# EAGLE design AquaNode Model A (EAGLE 7.3.0)
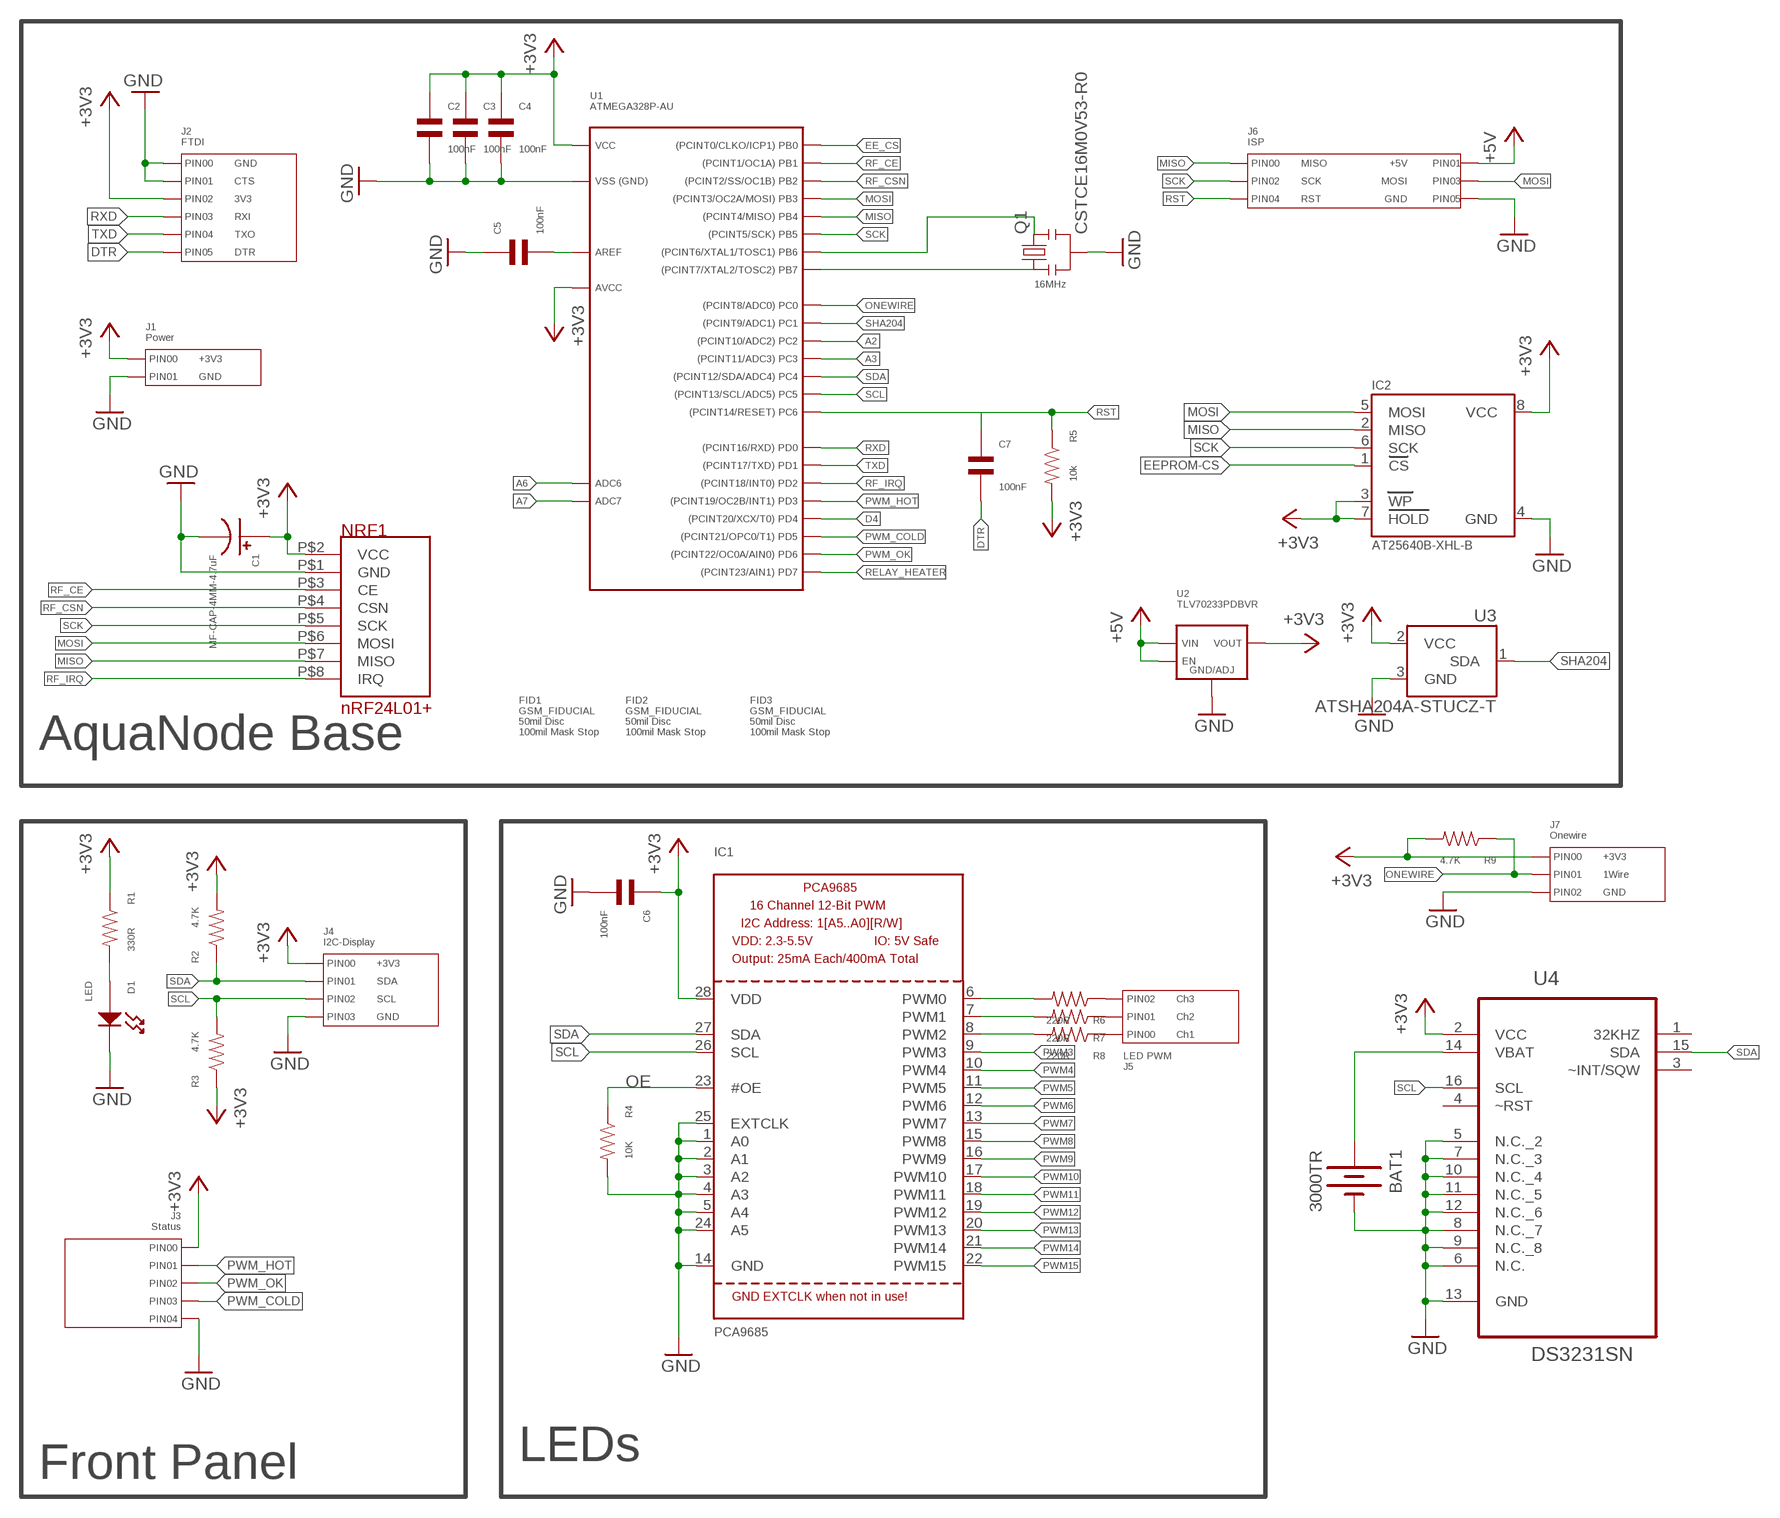
[diagram p0: schematic, sheet 1]

## Parts
BAT1  3000TR  BATTERY12MM  [BATTCON_12MM]
C1  MF-CAP-4MM-4.7uF  CAPACITOR_P_4MM  [CP4MM]
C2  100nF  CAPACITOR_NP_0603  [C0603]
C3  100nF  CAPACITOR_NP_0603  [C0603]
C4  100nF  CAPACITOR_NP_0603  [C0603]
C5  100nF  CAPACITOR_NP_0603  [C0603]
C6  100nF  CAPACITOR_NP_0603  [C0603]
C7  100nF  CAPACITOR_NP_0603  [C0603]
D1  LED  LED_SINGLE_0805  [LED0805]
FID1  GSM_FIDUCIAL  [GSM_FIDUCIAL]
FID2  GSM_FIDUCIAL  [GSM_FIDUCIAL]
FID3  GSM_FIDUCIAL  [GSM_FIDUCIAL]
IC1  PCA9685  [TSSOP28]
IC2  AT25640B-XHL-B  EEPROM_SPI_AT25040ATSSOP  [TSSOP8-4.4MM]
J1  Power  HEADER_01X02_PTH_2.54MM  [PTH_2.54MM_01X02]
J2  FTDI  HEADER_01X06_PTH_2.54MM  [PTH_2.54MM_01X06]
J3  Status  HEADER_01X05_PTH_2.54MM  [PTH_2.54MM_01X05]
J4  I2C-Display  HEADER_01X04_PTH_2.54MM  [PTH_2.54MM_01X04]
J5  LED PWM  HEADER_01X03_PTH_2.54MM  [PTH_2.54MM_01X03]
J6  ISP  HEADER_02X03_PTH_2.54MM  [PTH_2.54MM_02X03]
J7  Onewire  HEADER_01X03_PTH_2.54MM  [PTH_2.54MM_01X03]
NRF1  4Fx2-254mm  NRF24L01+.EBAY  [NRF24L01+.EBAY]
Q1  CSTCE16M0V53-R0  RESONATORSMD  [RESONATOR-SMD]
R1  330R  RESISTOR_0603  [R0603]
R2  4.7K  RESISTOR_0603  [R0603]
R3  4.7K  RESISTOR_0603  [R0603]
R4  10K  RESISTOR_0603  [R0603]
R5  10k  RESISTOR_0603  [R0603]
R6  220R  RESISTOR_0603  [R0603]
R7  220R  RESISTOR_0603  [R0603]
R8  220R  RESISTOR_0603  [R0603]
R9  4.7K  RESISTOR_0603  [R0603]
U1  ATMEGA328P-AU  [TQFP32]
U2  TLV70233PDBVR  [SOT-23-5]
U3  ATSHA204A-STUCZ-T  ATSHA204-TSU  [SOT23-3]
U4  DS3231SN  [SOIC127P1032X265-16N]

## Nets
+3V3 [power1]: C1.P$1 C2.P$1 C3.P$1 C4.P$1 C6.P$1 IC1.28(VDD) IC2.3(WP) IC2.7(HOLD) IC2.8(VCC) J1.P$2(PIN0) J2.P$3(PIN2) J3.P$1(PIN0) J4.P$1(PIN0) J7.P$1(PIN0) NRF1.P$2(VCC) R1.P$1 R2.P$2 R3.P$1 R5.P$2 R9.P$2 U1.P$4(VCC) U1.P$6(VCC) U1.P$18(AVCC) U2.P$5(VOUT) U3.2(VCC) U4.2(VCC)
+5V [power1]: J6.P$2(PIN1) U2.P$1(VIN) U2.P$3(EN)
A2: U1.P$25(PC2)
A3: U1.P$26(PC3)
A6: U1.P$19(ADC6)
A7: U1.P$22(ADC7)
D4: U1.P$2(PD4)
DTR: C7.P$2 J2.P$6(PIN5)
EE_CS: U1.P$12(PB0)
EEPROM-CS: IC2.1(CS)
GND [power1]: BAT1.GND(-) C1.P$2 C2.P$2 C3.P$2 C4.P$2 C5.P$1 C6.P$2 D1.CATHODE IC1.1(A0) IC1.2(A1) IC1.3(A2) IC1.4(A3) IC1.5(A4) IC1.14(GND) IC1.24(A5) IC1.25(EXTCLK) IC2.4(GND) J1.P$1(PIN1) J2.P$1(PIN0) J2.P$2(PIN1) J3.P$5(PIN4) J4.P$4(PIN3) J6.P$6(PIN5) J7.P$3(PIN2) NRF1.P$1(GND) Q1.2 R4.P$2 U1.P$3(GND) U1.P$5(GND) U1.P$21(GND) U2.P$2(GND/ADJ) U3.3(GND) U4.5(N.C._2) U4.6(N.C.) U4.7(N.C._3) U4.8(N.C._7) U4.9(N.C._8) U4.10(N.C._4) U4.11(N.C._5) U4.12(N.C._6) U4.13(GND)
MISO: IC2.2(MISO) J6.P$1(PIN0) NRF1.P$7(MISO) U1.P$16(PB4)
MOSI: IC2.5(MOSI) J6.P$4(PIN3) NRF1.P$6(MOSI) U1.P$15(PB3)
N$1: D1.ANODE R1.P$2
N$2: J5.P$3(PIN2) R6.P$1
N$3: J5.P$2(PIN1) R7.P$1
N$4: C5.P$2 U1.P$20(AREF)
N$5: BAT1.PWR@1(+) U4.14(VBAT)
N$6: J5.P$1(PIN0) R8.P$1
N$22: Q1.3 U1.P$7(PB6)
N$23: Q1.1 U1.P$8(PB7)
OE: IC1.23(#OE) R4.P$1
ONEWIRE: J7.P$2(PIN1) R9.P$1 U1.P$23(PC0)
PWM0: IC1.6(PWM0) R6.P$2
PWM1: IC1.7(PWM1) R7.P$2
PWM2: IC1.8(PWM2) R8.P$2
PWM3: IC1.9(PWM3)
PWM4: IC1.10(PWM4)
PWM5: IC1.11(PWM5)
PWM6: IC1.12(PWM6)
PWM7: IC1.13(PWM7)
PWM8: IC1.15(PWM8)
PWM9: IC1.16(PWM9)
PWM10: IC1.17(PWM10)
PWM11: IC1.18(PWM11)
PWM12: IC1.19(PWM12)
PWM13: IC1.20(PWM13)
PWM14: IC1.21(PWM14)
PWM15: IC1.22(PWM15)
PWM_COLD: J3.P$4(PIN3) U1.P$9(PD5)
PWM_HOT: J3.P$2(PIN1) U1.P$1(PD3)
PWM_OK: J3.P$3(PIN2) U1.P$10(PD6)
RELAY_HEATER: U1.P$11(PD7)
RF_CE: NRF1.P$3(CE) U1.P$13(PB1)
RF_CSN: NRF1.P$4(CSN) U1.P$14(PB2)
RF_IRQ: NRF1.P$8(IRQ) U1.P$32(PD2)
RST: C7.P$1 J6.P$5(PIN4) R5.P$1 U1.P$29(PC6)
RXD: J2.P$4(PIN3) U1.P$30(PD0)
SCK: IC2.6(SCK) J6.P$3(PIN2) NRF1.P$5(SCK) U1.P$17(PB5)
SCL: IC1.26(SCL) J4.P$3(PIN2) R3.P$2 U1.P$28(PC5) U4.16(SCL)
SDA: IC1.27(SDA) J4.P$2(PIN1) R2.P$1 U1.P$27(PC4) U4.15(SDA)
SHA204: U1.P$24(PC1) U3.1(SDA)
TXD: J2.P$5(PIN4) U1.P$31(PD1)
Unconnected: U4.1(32KHZ) U4.3(~INT/SQW) U4.4(~RST)

## Notes on the sheet
- 16MHz
- AquaNode Base
- LEDs
- Front Panel

## Library data of the parts
BAT1 = SparkFun-Electromechanical:BATTERY: Battery Holders Various common sizes : AA, AAA, 20mm coin cell and 12mm coin cell. 20MM_4LEGS, BATT-10373
C1 = MF_Passives:CAPACITOR_P: Library: MF_Passives Description: Device for Polarized Capacitors. Manufacture part number (MFG#), Voltage Rating, and Tolerance can be added via Attributes.; MFG#: N/A; TOLERANCE: N/A; VOLTAGE: N/A
C2-C7 = MF_Passives:CAPACITOR_NP: Library: MF_Passives Description: Device for Non-Polarized Capacitors. Manufacture part number (MFG#), Voltage, Temperature Coefficient, and Tolerance can be added via Attributes.; MFG#: N/A; TEMP_COF: N/A; TOLERANCE: N/A; VOLTAGE: N/A
D1 = MF_LEDs:LED_SINGLE: Library: MF_LEDs Description: Device for Single LED Packages. Manufacture part number (MFG#) can be added via Attributes.
FID1-FID3 = MF_Aesthetics:GSM_FIDUCIAL: Library: MF_Aesthetics Description: Fiducial marking for PCB alignment inside PNP and other machines.
IC1 = microbuilder:PCA9685: PCA9685 - 16 Channel 12-Bit I2C PWM Controller 5.0V tolerant 16 channel, 12-bit I2C PWM controller with 25mA per output (max. 400mA total) Digikey: 568-5931-1-ND
IC2 = microbuilder:EEPROM_SPI_AT25040A: AT25010a/40a EEPROM SOIC8 AT25010a, 1K (128 x 8 bit) - Digikey: AT25010AN-10SU2.7-ND AT25040a, 4K (256 x 8 bit) - Digikey: AT25040AN-10SU1.8-ND TSSOP8 AT25010a, 1K (128 x 8 bit) - Digikey: AT25010A-10TU-1.8-ND AT25040a, 4K (256 x 8 bit) - Digikey: AT25040A-10TU-1.8-ND
J1 = MF_Connectors:HEADER_01X02: Library: MF_Connectors Description: Header Connector with 02 Positions and 01 Rows. Use the LABEL Attribute to label the pin on the schematic and PCB. You can remove the attributes on the PCB by using the SMASH function on the part and then deleting the text.; LABEL00: +3V3; LABEL01: GND
J2 = MF_Connectors:HEADER_01X06: Library: MF_Connectors Description: Header Connector with 6 Positions and 01 Rows. Use the LABEL Attribute to label the pin on the schematic and PCB. You can remove the attributes on the PCB by using the SMASH function on the part and then deleting the text.; LABEL00: GND; LABEL01: CTS; LABEL02: 3V3; LABEL03: RXI; LABEL04: TXO; LABEL05: DTR
J3 = MF_Connectors:HEADER_01X05: Library: MF_Connectors Description: Header Connector with 5 Positions and 01 Rows. Use the LABEL Attribute to label the pin on the schematic and PCB. You can remove the attributes on the PCB by using the SMASH function on the part and then deleting the text.; LABEL00: +3V3; LABEL01: Hot; LABEL02: OK; LABEL03: Cold; LABEL04: GND
J4 = MF_Connectors:HEADER_01X04: Library: MF_Connectors Description: Header Connector with 04 Positions and 01 Rows. Use the LABEL Attribute to label the pin on the schematic and PCB. You can remove the attributes on the PCB by using the SMASH function on the part and then deleting the text.; LABEL00: +3V3; LABEL01: SDA; LABEL02: SCL; LABEL03: GND
J5 = MF_Connectors:HEADER_01X03: Library: MF_Connectors Description: Header Connector with 03 Positions and 01 Rows. Use the LABEL Attribute to label the pin on the schematic and PCB. You can remove the attributes on the PCB by using the SMASH function on the part and then deleting the text.; LABEL00: Ch1; LABEL01: Ch2; LABEL02: Ch3
J6 = MF_Connectors:HEADER_02X03: Library: MF_Connectors Description: Header Connector with 6 Positions and 02 Rows. Use the LABEL Attribute to label the pin on the schematic and PCB. You can remove the attributes on the PCB by using the SMASH function on the part and then deleting the text.; LABEL00: MISO; LABEL01: +5V; LABEL02: SCK; LABEL03: MOSI; LABEL04: RST; LABEL05: GND
J7 = MF_Connectors:HEADER_01X03: Library: MF_Connectors Description: Header Connector with 03 Positions and 01 Rows. Use the LABEL Attribute to label the pin on the schematic and PCB. You can remove the attributes on the PCB by using the SMASH function on the part and then deleting the text.; LABEL00: +3V3; LABEL01: 1Wire; LABEL02: GND
NRF1 = TDK:NRF24L01+.EBAY
Q1 = _allyourbase:RESONATOR: Resonator Small SMD resonator. This is the itty bitty 10/20MHz resonators with built in caps. CSTCE10M0G55 and CSTCE20M0V53. Footprint has been reviewed closely but hasn't been tested yet.
R1-R9 = MF_Passives:RESISTOR: Library: MF_Passives Description: Device for Resistors. Manufacture part number (MFG#), Voltage, Tolerance, and Wattage Rating can be added via Attributes.; MFG#: N/A; TOLERANCE: N/A; VOLTAGE: N/A; WATTAGE: N/A
U1 = MF_IC_Digital:ATMEGA328P: Manufacturer Part #: ATMEGA328P Manufacturer: Atmel Description: 8-bit Microcontrollers - MCU 32KB In-system Flash 20MHz 1.8V-5.5V
U2 = MF_IC_Power:TLV702: Manufacturer Part #: TLV702 Manufacturer: Texas Instruments Description: LDO Voltage Regulators
U3 = SparkFun-DigitalIC:ATSHA204: Atmel ATSHA204 The Atmel ATSHA204 is an optimized authentication chip that includes a 4.5Kb EEPROM. This array can be used for storage of keys, miscellaneous read/write, read-only, password or secret data, and consumption tracking. Access to the various sections of memory can be restricted in a variety of ways and then the configuration locked to prevent changes.
U4 = Maxim_By_element14_Batch_1:DS3231SN: Extremely Accurate I2C-Integrated RTC/TCXO/Crystal; MPN: DS3231SN#; OC_FARNELL: 1593292; OC_NEWARK: 68K3406; PACKAGE: SOIC-16; SUPPLIER: Maxim

## Net classes
2 VIN: width 0.762 mm, clearance 0.381 mm

## Board
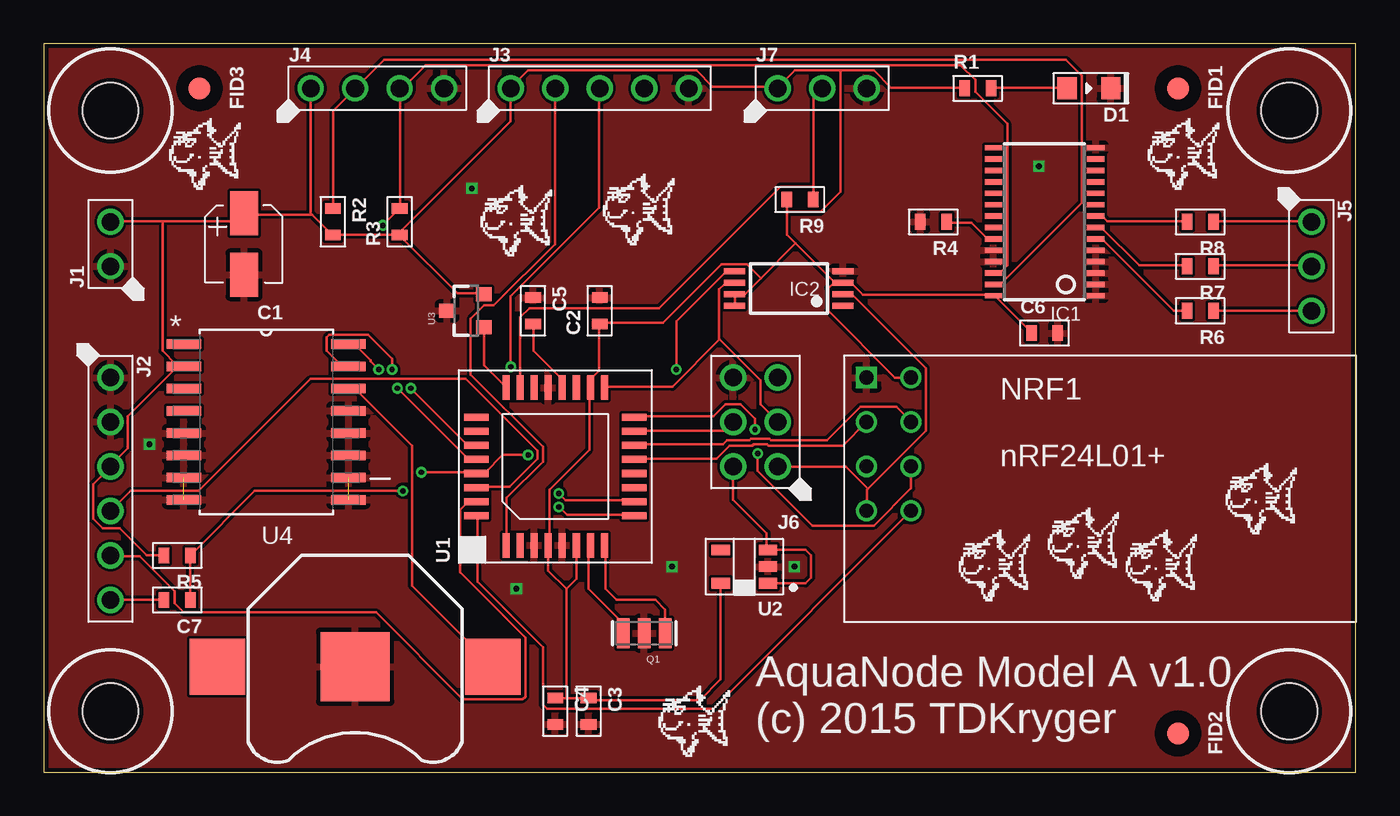
[diagram p1: board, top side]
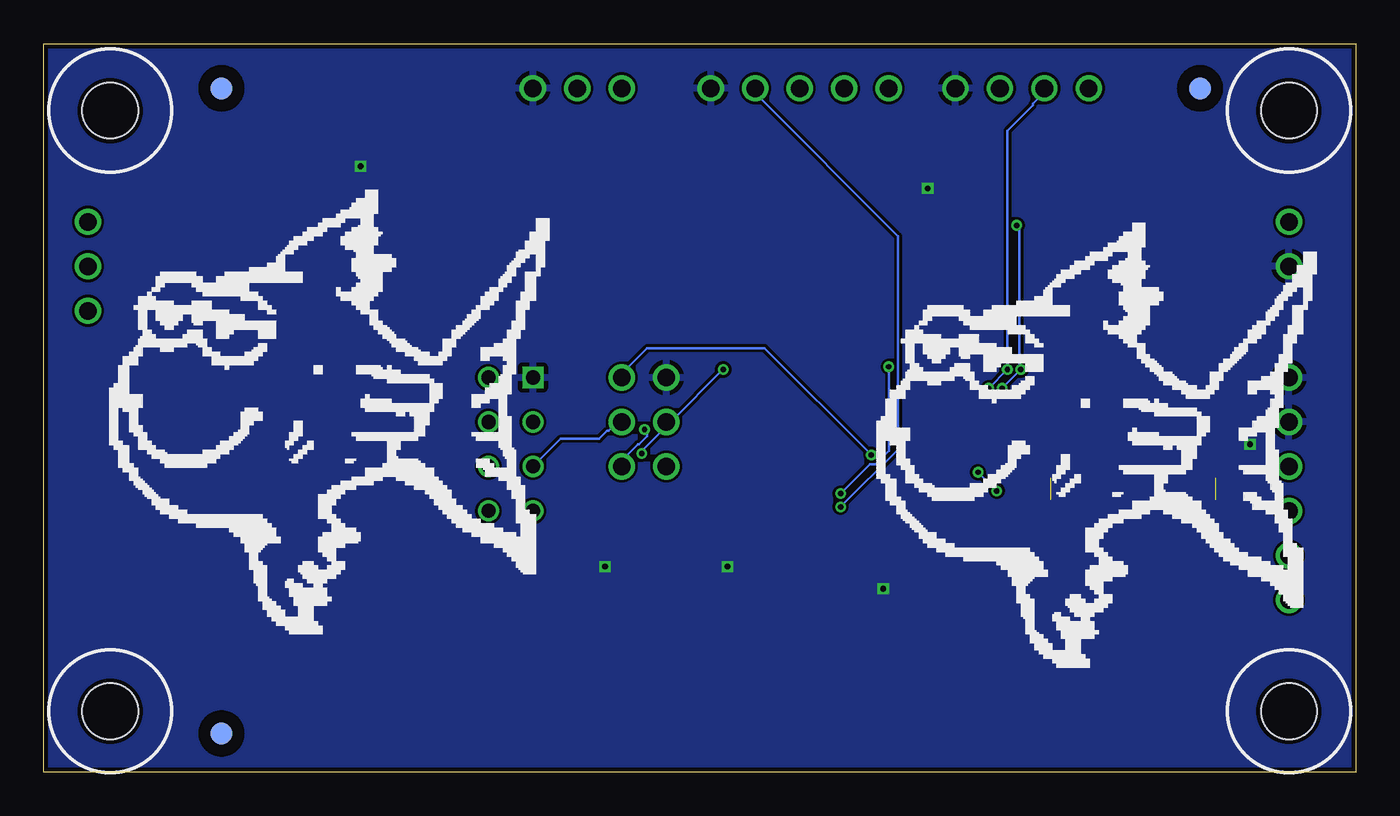
[diagram p2: board, bottom side, seen from below]

Size 74.92 x 41.58 mm. Coordinates in mm from the lower left corner, seen from the top.
Outline: 0,41.58 0,0 74.92,0 74.92,41.58 0,41.58
Copper layers (1*16): Top 0.035mm / dielectric 0.2mm / Bottom 0.035mm
Design rules "MacroFab_MF_2_Layer": minimum track width 6mil, minimum drill 12mil, track to track 6mil, track to pad 6mil, pad to pad 6mil, via to via 6mil, smd to smd 0mil, copper to edge 10mil, drill to drill 10mil, minimum pad ring 6mil, minimum via ring 6mil, stop-mask expansion 2mil, vias tented up to drill 25mil, thermal gap 10mil

### Footprints (pad centres in the part's own frame; a part is rotated, then mirrored left to right if it is on the bottom)
BATTCON_12MM = smd 3.962 x 3.962: GND 0,0 | smd 3.175 x 3.175: PWR@1 -7.874,0; PWR@2 7.874,0
CP4MM = smd 1.6 x 2.5: P$1 0,-1.75; P$2 0,1.75
C0603 = smd 0.6 x 0.9: P$1 -0.75,0; P$2 0.75,0
LED0805 = smd 1.1 x 1.25: ANODE 1.25,0; CATHODE -1.25,0
GSM_FIDUCIAL = smd 1.27 x 1.27: P$1 0,0 | smd 1.27 x 1.27 bottom: P$2 0,0
TSSOP28 = smd 0.305 x 0.991: 1 -4.225,-2.918; 2 -3.575,-2.918; 3 -2.925,-2.918; 4 -2.275,-2.918; 5 -1.625,-2.918; 6 -0.975,-2.918; 7 -0.325,-2.918; 8 0.325,-2.918; 9 0.975,-2.918; 10 1.625,-2.918; 11 2.275,-2.918; 12 2.925,-2.918; 13 3.575,-2.918; 14 4.225,-2.918; 15 4.225,2.918; 16 3.575,2.918; 17 2.925,2.918; 18 2.275,2.918; 19 1.625,2.918; 20 0.975,2.918; 21 0.325,2.918; 22 -0.325,2.918; 23 -0.975,2.918; 24 -1.625,2.918; 25 -2.275,2.918; 26 -2.925,2.918; 27 -3.575,2.918; 28 -4.225,2.918
TSSOP8-4.4MM = smd 1.2 x 0.35: 1 -3.1,0.975; 2 -3.1,0.325; 3 -3.1,-0.325; 4 -3.1,-0.975; 5 3.1,-0.975; 6 3.1,-0.325; 7 3.1,0.325; 8 3.1,0.975
PTH_2.54MM_01X02 = drill 1: P$1 -1.27,0; P$2 1.27,0
PTH_2.54MM_01X06 = drill 1: P$1 -6.35,0; P$2 -3.81,0; P$3 -1.27,0; P$4 1.27,0; P$5 3.81,0; P$6 6.35,0
PTH_2.54MM_01X05 = drill 1: P$1 -5.08,0; P$2 -2.54,0; P$3 0,0; P$4 2.54,0; P$5 5.08,0
PTH_2.54MM_01X04 = drill 1: P$1 -3.81,0; P$2 -1.27,0; P$3 1.27,0; P$4 3.81,0
PTH_2.54MM_01X03 = drill 1: P$1 -2.54,0; P$2 0,0; P$3 2.54,0
PTH_2.54MM_02X03 = drill 1: P$1 -2.54,-1.27; P$2 -2.54,1.27; P$3 0,-1.27; P$4 0,1.27; P$5 2.54,-1.27; P$6 2.54,1.27
NRF24L01+.EBAY = drill 0.8 square: P$1 -1.27,5.08 | drill 0.8: P$2 1.27,5.08; P$3 -1.27,2.54; P$4 1.27,2.54; P$5 -1.27,0; P$6 1.27,0; P$7 -1.27,-2.54; P$8 1.27,-2.54
RESONATOR-SMD = smd 0.7 x 1.7: 1 -1.2,0; 2 0,0; 3 1.2,0
R0603 = smd 0.6 x 0.9: P$1 -0.75,0; P$2 0.75,0
TQFP32 = smd 1.4 x 0.4: P$1 -4.5,2.8; P$2 -4.5,2; P$3 -4.5,1.2; P$4 -4.5,0.4; P$5 -4.5,-0.4; P$6 -4.5,-1.2; P$7 -4.5,-2; P$8 -4.5,-2.8; P$17 4.5,-2.8; P$18 4.5,-2; P$19 4.5,-1.2; P$20 4.5,-0.4; P$21 4.5,0.4; P$22 4.5,1.2; P$23 4.5,2; P$24 4.5,2.8 | smd 0.4 x 1.4: P$9 -2.8,-4.5; P$10 -2,-4.5; P$11 -1.2,-4.5; P$12 -0.4,-4.5; P$13 0.4,-4.5; P$14 1.2,-4.5; P$15 2,-4.5; P$16 2.8,-4.5; P$25 2.8,4.5; P$26 2,4.5; P$27 1.2,4.5; P$28 0.4,4.5; P$29 -0.4,4.5; P$30 -1.2,4.5; P$31 -2,4.5; P$32 -2.8,4.5
SOT-23-5 = smd 1.05 x 0.6: P$1 -1.35,0.95; P$2 -1.35,0; P$3 -1.35,-0.95; P$4 1.35,-0.95; P$5 1.35,0.95
SOT23-3 = smd 0.8 x 0.9: 1 -0.95,-1; 2 0.95,-1; 3 0,1.1
SOIC127P1032X265-16N = smd 1.981 x 0.533: 1 -4.699,4.445; 2 -4.699,3.175; 3 -4.699,1.905; 4 -4.699,0.635; 5 -4.699,-0.635; 6 -4.699,-1.905; 7 -4.699,-3.175; 8 -4.699,-4.445; 9 4.699,-4.445; 10 4.699,-3.175; 11 4.699,-1.905; 12 4.699,-0.635; 13 4.699,0.635; 14 4.699,1.905; 15 4.699,3.175; 16 4.699,4.445
HOLE3.2 = hole 3.2: 0,0

### Placement (x,y rotation side)
BAT1  17.78,6.02 180 top
C1  11.43,30.15 180 top
C2  31.75,26.34 90 top
C3  31.11,3.48 270 top
C4  29.21,3.48 270 top
C5  27.94,26.34 270 top
C6  57.15,25.07 0 top
C7  7.62,9.83 180 top
D1  59.69,39.04 180 top
FID1  64.77,39.04 270 top
FID2  64.77,2.21 270 top
FID3  8.89,39.04 270 top
IC1  57.15,31.42 90 top
IC2  42.55,27.61 180 top
J1  3.81,30.15 90 top
J2  3.81,16.18 270 top
J3  31.75,39.04 0 top
J4  19.05,39.04 0 top
J5  72.39,28.88 270 top
J6  40.64,19.99 90 top
J7  44.45,39.04 0 top
NRF1  48.26,17.45 0 top
Q1  34.29,7.93 180 top
R1  53.34,39.04 0 top
R2  16.51,31.42 270 top
R3  20.32,31.42 90 top
R4  50.8,31.42 180 top
R5  7.62,12.37 180 top
R6  66.04,26.34 180 top
R7  66.04,28.88 180 top
R8  66.04,31.42 180 top
R9  43.18,32.69 180 top
U1  29.21,17.45 90 top
U2  40.01,11.73 180 top
U3  24.13,26.34 90 top
U4  12.7,19.99 0 top
U$1  [HOLE3.2]  71.12,37.77 270 top
U$2  [HOLE3.2]  3.81,37.77 270 top
U$3  [HOLE3.2]  3.81,3.48 270 top
U$4  [HOLE3.2]  71.12,3.48 270 top
U$5  [THEFISH_SMALL]  36.83,2.84 0 top
U$6  [THEFISH_SMALL]  26.67,31.42 0 top
U$7  [THEFISH_SMALL]  64.77,35.23 0 top
U$8  [THEFISH]  27.3,6.02 0 bottom
U$9  [THEFISH]  71.12,7.93 0 bottom
U$10  [THEFISH_SMALL]  33.66,32.05 0 top
U$11  [THEFISH_SMALL]  8.89,35.23 0 top
U$12  [THEFISH_SMALL]  69.22,15.54 0 top
U$13  [THEFISH_SMALL]  63.5,11.73 0 top
U$14  [THEFISH_SMALL]  59.05,13.01 0 top
U$15  [THEFISH_SMALL]  53.98,11.73 0 top

### Tracks (layer width: path | path; a pad name or v marks a point on that pad's centre or on a via)
+3V3
  Top 0.152: U2.P$5 38.66,5.3 37.47,4.12 31.23,4.12 C3.P$1 29.84,4.23 | 29.84,4.23 C4.P$1 | U1.P$6 30.41,11.03 29.84,10.46 | 29.84,10.46 29.84,4.23 | 29.84,10.46 28.81,11.5 U1.P$4 28.88,13.01 28.88,16.13 31.17,18.42 31.17,21.92 U1.P$18 31.24,22 31.24,22.45 31.7,22.91 31.7,25.58 C2.P$1 31.77,25.65 35.36,25.65 38.71,29.01 40.16,29.01 40.96,28.21 | 45.49,40.06 42.9,40.06 41.91,39.07 J7.P$1 41.91,39.14 38.18,39.14 37.26,40.06 27.66,40.06 26.67,39.07 J3.P$1 26.67,37.16 20.27,30.76 R3.P$1 | 45.49,40.06 47.4,40.06 48.39,39.07 52.58,39.07 R1.P$1 | C6.P$1 56.39,25.12 54.25,27.25 IC1.28 54.18,27.25 46.79,27.25 46.18,27.86 45.72,27.86 IC2.3 | IC2.8 39.47,26.65 39.47,27.25 IC2.7 39.55,27.25 40.01,27.25 40.96,28.21 | 42.44,31.98 42.44,30.68 42.94,30.19 | 42.44,31.98 42.44,32.66 R9.P$2 | 42.94,30.19 45.19,27.94 IC2.3 | 42.94,30.19 40.96,28.21 | NRF1.P$2 48.62,22.53 44.81,26.34 44.81,27.64 45.11,27.94 IC2.3 | 45.49,40.06 45.49,33.12 44.35,31.98 42.44,31.98 | R5.P$2 6.86,12.39 5.87,12.39 4.34,13.92 3.35,13.92 2.82,14.45 2.82,16.43 3.81,17.43 J2.P$3 3.81,17.5 4.8,18.49 4.8,20.32 7.62,23.14 8,23.14 U4.2 7.54,23.14 7.54,23.29 6.78,24.05 6.78,31.45 | R3.P$1 20.27,30.68 16.54,30.68 R2.P$2 16.46,30.68 15.32,31.83 15.24,31.83 | U3.2 25.07,27.33 23.62,27.33 20.34,30.61 R3.P$1 | 15.24,31.83 11.43,31.83 | 6.78,31.45 11.05,31.45 11.43,31.83 | 6.78,31.45 3.81,31.45 J1.P$2 | 11.43,31.83 C1.P$1 | 15.24,31.83 J4.P$1
+5V
  Top 0.152: J6.P$2 39.37,15.54 41.27,13.64 41.27,12.77 U2.P$3 43.5,12.69 43.81,12.37 43.81,11.1 43.5,10.78 U2.P$1
DTR
  Top 0.152: C7.P$2 J2.P$6
GND  (via drill 0.33)  (2 unrouted)
  other vias: 42.86,11.73 6.03,18.72 24.45,33.33 56.83,34.59 26.99,10.46 35.88,11.73
  pour Bottom: -1.27,42.85 76.2,42.85 76.2,-1.6 -1.27,-1.6
  pour Top: -2.54,44.12 77.47,44.12 77.47,-2.87 -2.54,-2.87
MISO  (via drill 0.3)
  Top 0.152: v40.62,19.56 40.62,20.17 39.78,21.01 38.94,21.01 38.25,20.32 33.76,20.32 U1.P$16 | 47.05,16.17 47.02,16.13 47.02,14.91 NRF1.P$7 | 47.05,16.17 50.37,19.48 50.37,23.06 46.18,27.25 45.72,27.25 IC2.2 | 47.05,16.17 45.8,17.43 41.91,17.43 J6.P$1
  Bottom 0.152: v40.62,19.56 40.46,19.41 40.46,19.18 40.92,18.72 41,18.72 41.91,17.81 J6.P$1
MOSI  (via drill 0.3)
  Top 0.152: v36.12,22.99 36.12,25.73 38.94,28.55 39.4,28.55 IC2.5 | J6.P$4 38.86,19.48 33.76,19.48 U1.P$15 | NRF1.P$6 49.53,16.21 47.4,14.07 43.89,14.07 40.77,17.2 v40.77,18.19
  Bottom 0.152: v36.12,22.99 39.09,20.02 39.32,20.02 J6.P$4 39.4,19.94 39.4,19.71 40.77,18.34 v40.77,18.19
N$1
  Top 0.152: R1.P$2 54.1,39.07 58.37,39.07 D1.ANODE
N$2
  Top 0.152: J5.P$3 R6.P$1
N$3
  Top 0.152: R7.P$1 66.83,28.93 72.39,28.93 J5.P$2
N$4
  Top 0.152: C5.P$2 27.96,25.58 27.96,24.05 29.57,22.45 29.57,22 U1.P$20
N$5
  Top 0.152: BAT1.PWR@1 21.03,10.64 21.03,18.64 17.83,21.84 17.45,21.84 U4.14
N$6
  Top 0.152: R8.P$1 66.83,31.45 72.39,31.45 J5.P$1
N$22
  Top 0.152: Q1.3 33.09,8.49 31.11,10.46 31.11,12.86 U1.P$7
N$23
  Top 0.152: Q1.1 35.49,9.27 34.92,9.83 32.7,9.83 32.07,10.46 32.07,12.89 U1.P$8
OE
  Top 0.152: R4.P$1 51.59,31.37 52.96,31.37 53.87,30.46 54.18,30.46 IC1.23
ONEWIRE
  Top 0.152: 43.97,33.43 43.97,38.53 44.42,38.99 J7.P$2 | 43.97,33.43 43.97,32.74 R9.P$1 | 43.97,33.43 42.06,33.43 35.13,26.49 27.74,26.49 27.2,25.96 27.2,22 U1.P$23
PWM0
  Top 0.152: R6.P$2 64.54,26.34 60.5,30.38 60.12,30.38 IC1.6
PWM1
  Top 0.152: R7.P$2 65.23,28.93 62.56,28.93 60.43,31.06 60.12,31.06 IC1.7
PWM2
  Top 0.152: R8.P$2 65.23,31.45 60.73,31.45 60.5,31.67 60.12,31.67 IC1.8
PWM_COLD  (via drill 0.3)
  Top 0.152: v29.41,15.14 29.87,14.68 33.68,14.68 U1.P$9
  Bottom 0.152: v29.41,15.14 26.14,18.42 26.14,30.61 34.29,38.76 J3.P$4
PWM_HOT
  Top 0.152: U1.P$1 26.44,13.01 26.44,15.67 28.5,17.73 28.5,18.57 24.38,22.68 24.38,25.88 25.15,26.65 25.68,26.65 29.18,30.15 29.18,38.99 J3.P$2
PWM_OK  (via drill 0.3)
  Top 0.152: v29.41,15.9 29.79,15.52 33.68,15.52 U1.P$10 | v26.67,23.14 26.67,27.18 31.7,32.21 31.7,38.99 J3.P$3
  Bottom 0.152: v29.41,15.9 27.74,17.58 27.43,17.58 26.67,18.34 v26.67,23.14
RF_CE
  Top 0.152: NRF1.P$3 45.64,18.64 41.38,18.64 41.3,18.72 40.54,18.72 40.46,18.64 39.17,18.64 38.41,17.88 33.76,17.88 U1.P$13
RF_CSN
  Top 0.152: U1.P$14 33.76,18.72 38.79,18.72 39.01,18.95 40.31,18.95 40.39,19.03 41.45,19.03 41.53,18.95 44.73,18.95 46.63,20.85 48.69,20.85 49.53,20.02 NRF1.P$4
RF_IRQ
  Top 0.152: NRF1.P$8 38.25,3.63 28.73,3.63 28.5,3.86 28.5,7.14 24.77,10.87 24.77,14.61 U1.P$32
RST  (via drill 0.3)
  Top 0.152: C7.P$1 R5.P$1 8.38,12.39 12.04,16.05 v20.5,16.05 | v21.57,17.12 24.69,17.12 U1.P$29 24.77,17.12 25.22,17.12 26.21,18.11 v27.66,18.11
  Bottom 0.152: v20.5,16.05 v21.57,17.12 | J6.P$5 41.91,22.76 40.46,24.21 33.76,24.21 v27.66,18.11
RXD
  Top 0.152: J2.P$4 4.95,16.05 8.84,16.05 15.24,22.45 24.08,22.45 28.19,18.34 28.19,17.88 26.59,16.28 24.77,16.28 U1.P$30
SCK
  Top 0.152: 38.59,24.7 40.92,22.38 40.92,21.01 41.91,20.02 J6.P$3 | 38.59,24.7 38.56,24.74 38.56,27.56 38.86,27.86 39.4,27.86 IC2.6 | 38.59,24.7 35.89,22 32.08,22 U1.P$17
  Bottom 0.152: NRF1.P$5 45.41,19.03 43.2,19.03 42.75,19.48 42.67,19.48 42.22,19.94 41.91,19.94 J6.P$3
SCL  (via drill 0.3)
  Top 0.152: v20.19,21.92 24.23,17.88 24.69,17.88 U1.P$28 | v19.13,22.99 18.67,23.44 18.67,23.52 17.75,24.44 U4.16 | IC1.26 54.25,28.55 54.63,28.55 55.02,28.93 55.02,37.01 53.19,38.84 53.19,39.52 52.35,40.36 21.79,40.36 20.42,38.99 J4.P$3 20.34,38.99 20.34,32.21 R3.P$2 20.27,32.13 v19.36,31.22
  Bottom 0.152: v20.19,21.92 v19.13,22.99 19.2,22.99 19.2,31.06 v19.36,31.22
SDA  (via drill 0.3)
  Top 0.152: v20.95,21.92 24.16,18.72 24.69,18.72 U1.P$27 | v19.89,22.99 19.89,23.6 18.52,24.97 16.31,24.97 16.15,24.82 16.15,24.05 16.99,23.22 17.37,23.22 U4.15 | R2.P$1 16.54,32.21 16.54,37.77 17.75,38.99 J4.P$2 17.83,39.07 19.43,40.67 58.37,40.67 59.28,39.75 59.28,32.51 54.63,27.86 54.25,27.86 IC1.27
  Bottom 0.152: v20.95,21.92 v19.89,22.99 19.89,36.63 18.44,38.08 18.44,38.15 17.83,38.76 17.83,38.99 J4.P$2
SHA204
  Top 0.152: U3.1 25.15,25.35 25.15,23.22 26.36,22 U1.P$24
TXD
  Top 0.152: U1.P$31 24.69,15.44 24.23,15.44 23.77,14.99 23.77,11.4 27.51,7.67 27.51,4.32 27.36,4.17 23.93,4.17 18.97,9.12 8,9.12 7.47,9.65 7.47,10.34 5.49,12.32 3.81,12.32 J2.P$5

### Text on the board
tNames: AquaNode Model A v1.0 / (c) 2015 TDKryger